# EAGLE design usbkeyboard1 (EAGLE 7.1.0)
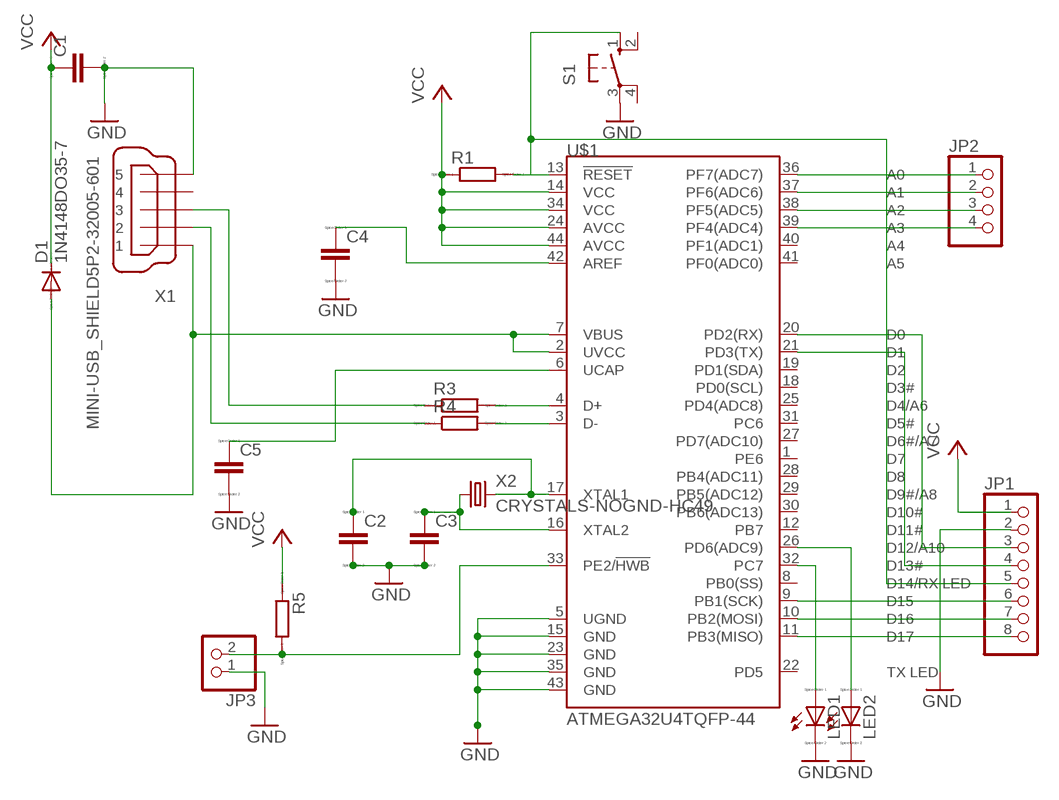
[diagram p0: schematic, sheet 1]

## Parts
C1  CC0603  [C0603]
C2  CC0603  [C0603]
C3  CC0603  [C0603]
C4  CC0603  [C0603]
C5  CC0603  [C0603]
D1  1N4148DO35-7  [DO35-7]
JP1  PINHD-1X8  [1X08]
JP2  PINHD-1X4  [1X04]
JP3  PINHD-1X2  [1X02]
LED1  LED_ELD260  [LED_LD260]
LED2  LED_ELD260  [LED_LD260]
R1  RR0603  [R0603]
R3  RR0603  [R0603]
R4  RR0603  [R0603]
R5  RR0603  [R0603]
S1  10-XX  [B3F-10XX]
U$1  ATMEGA32U4TQFP-44  [TQFP44]
X1  MINI-USB_SHIELD5P2-32005-601  [32005-601]
X2  CRYSTALS-NOGND-HC49  [HC49]

## Nets
GND: C1.2 C2.2 C3.2 C4.2 C5.2 JP1.2 JP3.1 LED1.K(C) LED2.K(C) S1.3(P) U$1.5(UGND) U$1.15(GND) U$1.23(GND) U$1.35(GND) U$1.43(GND) X1.5
N$1: JP1.8 U$1.11(PB3(MISO))
N$2: JP1.5 R1.2 S1.1(S) U$1.13(!RESET)
N$3: D1.A U$1.2(UVCC) U$1.7(VBUS) X1.1
N$4: R3.2 U$1.4(D+)
N$5: R4.2 U$1.3(D-)
N$6: R4.1 X1.2
N$7: R3.1 X1.3
N$8: C2.1 U$1.17(XTAL1) X2.2
N$9: C3.1 U$1.16(XTAL2) X2.1
N$10: JP1.7 U$1.10(PB2(MOSI))
N$11: JP1.6 U$1.9(PB1(SCK))
N$12: JP1.4 U$1.21(PD3(TX))
N$13: JP1.3 U$1.20(PD2(RX))
N$14: JP2.1 U$1.36(PF7(ADC7))
N$15: JP2.2 U$1.37(PF6(ADC6))
N$16: JP2.3 U$1.38(PF5(ADC5))
N$17: JP2.4 U$1.39(PF4(ADC4))
N$18: LED2.A U$1.26(PD6(ADC9))
N$19: LED1.A U$1.32(PC7)
N$20: JP3.2 R5.2 U$1.33(PE2/!HWB)
N$21: C4.1 U$1.42(AREF)
N$22: C5.1 U$1.6(UCAP)
VCC: C1.1 D1.C JP1.1 R1.1 R5.1 U$1.14(VCC) U$1.24(AVCC) U$1.34(VCC) U$1.44(AVCC)
Unconnected: S1.2(S1) S1.4(P1) U$1.1(PE6) U$1.8(PB0(SS)) U$1.12(PB7) U$1.18(PD0(SCL)) U$1.19(PD1(SDA)) U$1.22(PD5) U$1.25(PD4(ADC8)) U$1.27(PD7(ADC10)) U$1.28(PB4(ADC11)) U$1.29(PB5(ADC12)) U$1.30(PB6(ADC13)) U$1.31(PC6) U$1.40(PF1(ADC1)) U$1.41(PF0(ADC0)) X1.4 X1.M1(S1) X1.M2(S2)

## Library data of the parts
C1-C5 = eagle-ltspice:C: CAPACITOR, European symbol; SPICEMODEL: NONE; SPICEPREFIX: C
D1 = diode:1N4148: DIODE high speed (Philips)
JP1 = pinhead:PINHD-1X8: PIN HEADER
JP2 = pinhead:PINHD-1X4: PIN HEADER
JP3 = pinhead:PINHD-1X2: PIN HEADER
LED1 LED2 = eagle-ltspice:LED_E: LED Source: http://www.osram.convergy.de Source: www.luxeon.com Source: www.kingbright.com; SPICEMODEL: NONE; SPICEPREFIX: D; SPICETYPE: diode
R1 R3-R5 = eagle-ltspice:R: RESISTOR, European symbol; SPICEMODEL: NONE; SPICEPREFIX: R
S1 = switch-omron:10-XX: OMRON SWITCH; MPN: B3F-1000; OC_FARNELL: 176432; OC_NEWARK: 36M3542
U$1 = SparkFun-DigitalIC:ATMEGA32U4: Atmel 44-pin 8-bit Microcontroller with 32KBytes of ISP Flash and USB Controller
X1 = con-cypressindustries:MINI-USB_SHIELD5P2-: MINI USB-B R/A DIP 5pol. Source: www.cypressindustries.com; OC_FARNELL: unknown; OC_NEWARK: unknown
X2 = IQD-Frequency-Products:CRYSTALS-NOGND: CRYSTALS CAN NOT GROUNDED

## Board
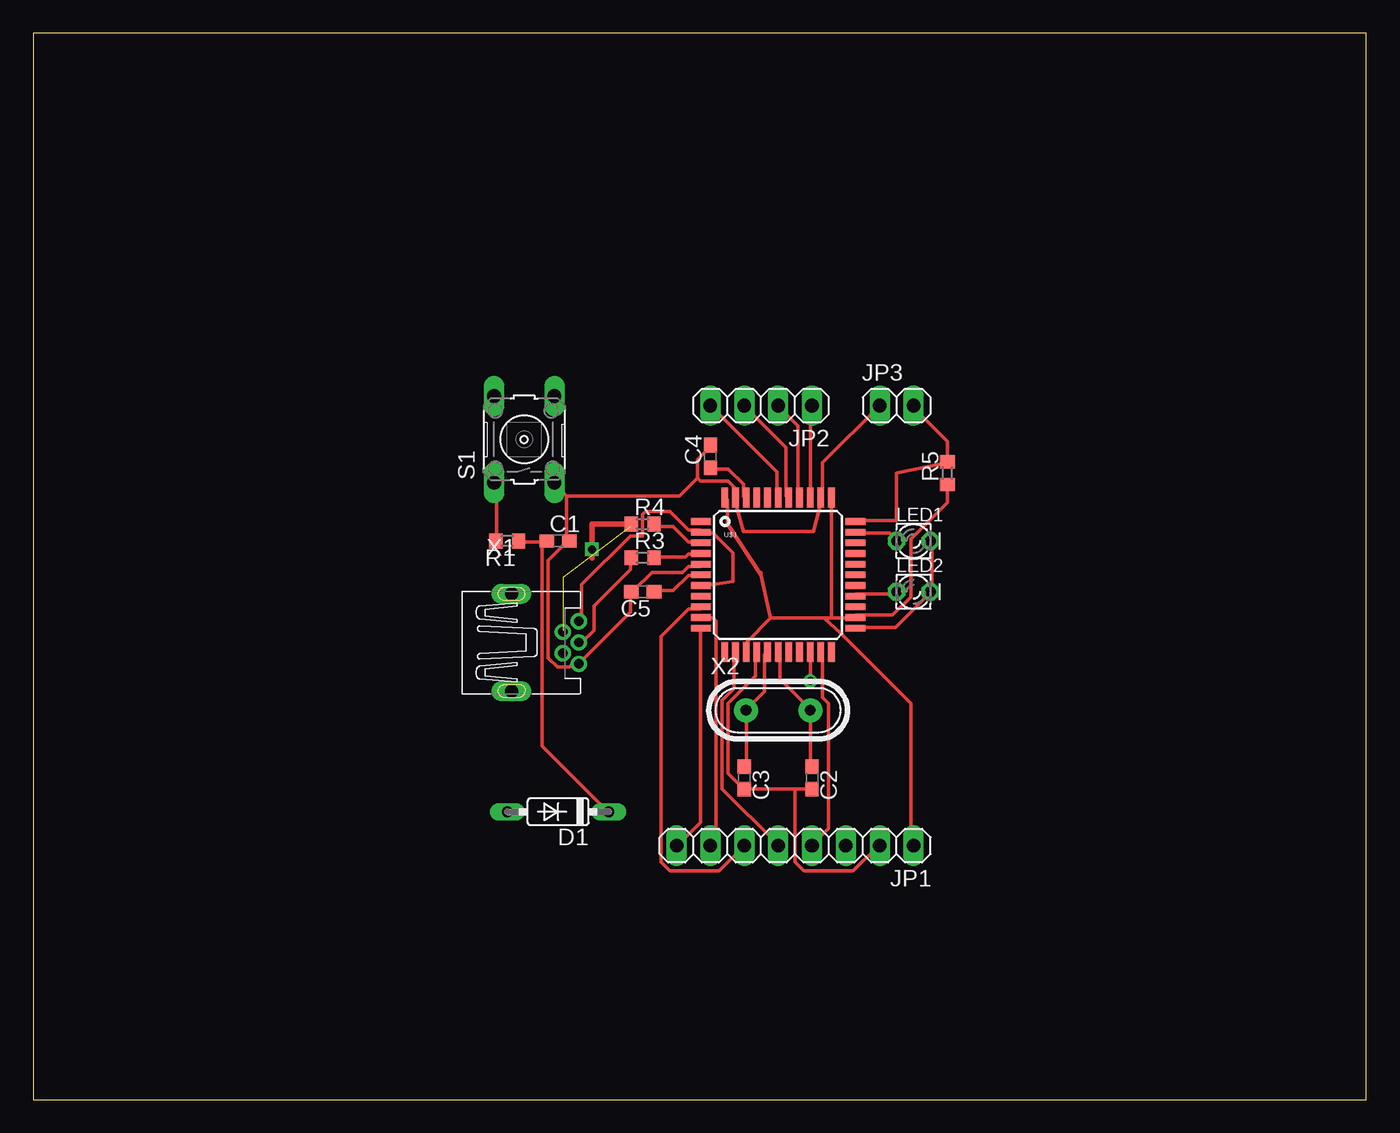
[diagram p1: board, top side]
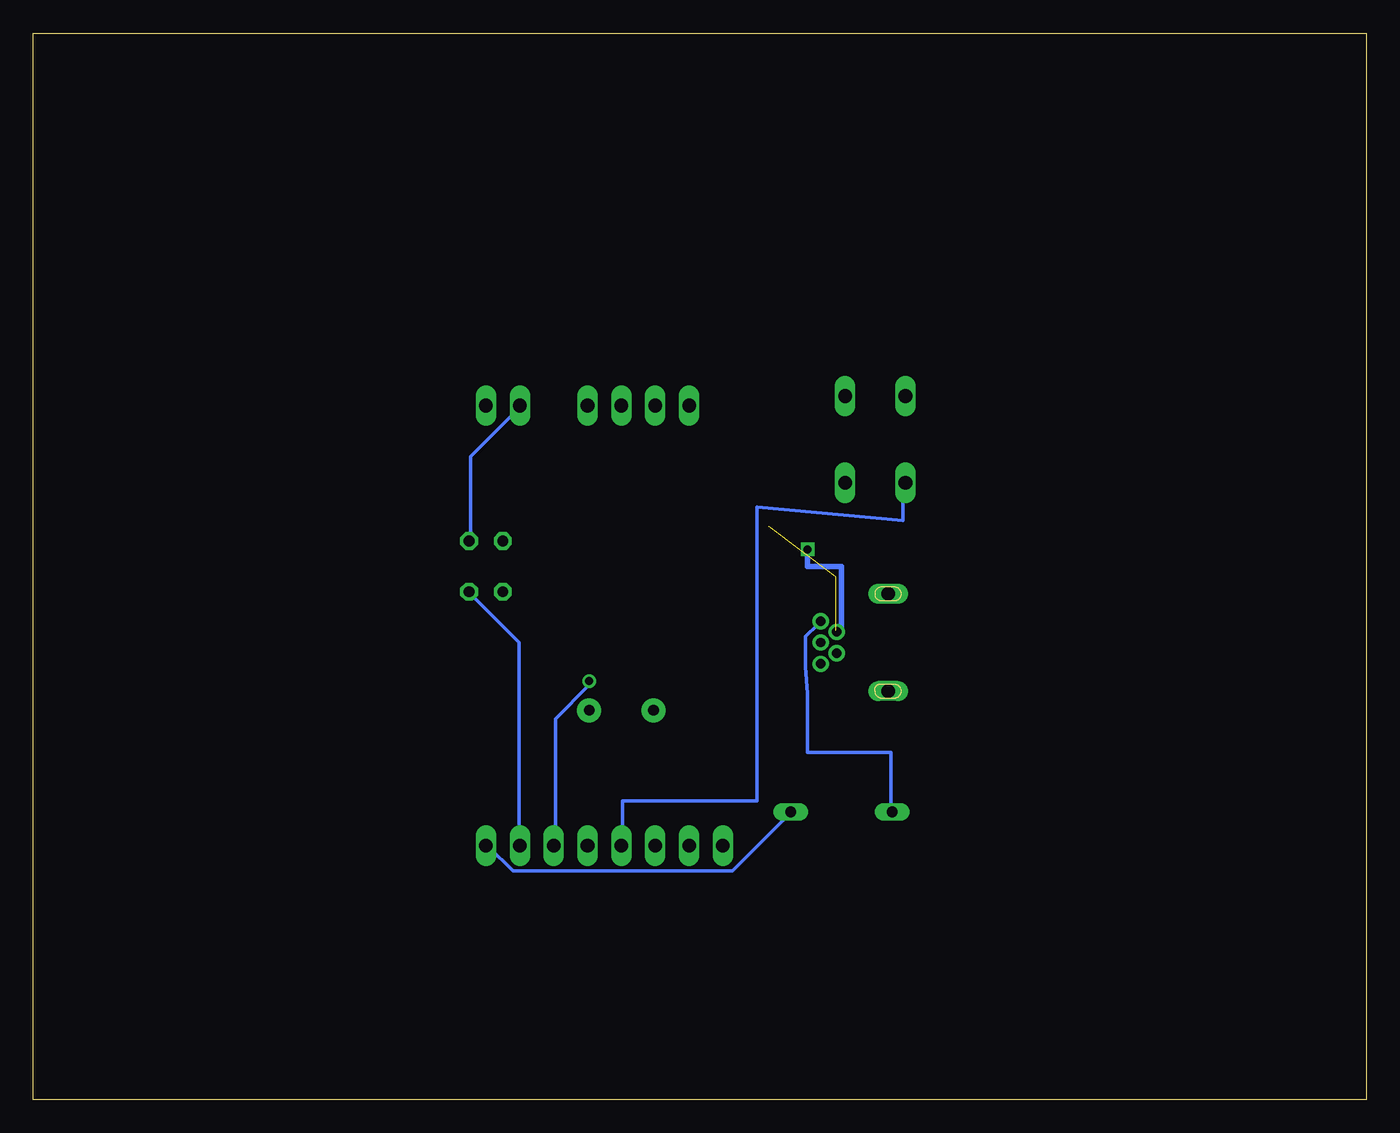
[diagram p2: board, bottom side, seen from below]

Size 100 x 80 mm. Coordinates in mm from the lower left corner, seen from the top.
Outline: 0,0 100,0 100,80 0,80 0,0
Copper layers (1*16): Top 0.035mm / dielectric 1.5mm / Bottom 0.035mm
Design rules "default": minimum track width 10mil, minimum drill 24mil, track to track 8mil, track to pad 8mil, pad to pad 8mil, via to via 8mil, smd to smd 8mil, copper to edge 40mil, drill to drill 8mil, minimum pad ring 10mil, minimum via ring 8mil, stop-mask expansion 4mil, vias tented up to drill 0mil, thermal gap 10mil

### Footprints (pad centres in the part's own frame; a part is rotated, then mirrored left to right if it is on the bottom)
C0603 = smd 1.1 x 1: 1 -0.85,0; 2 0.85,0
DO35-7 = drill 0.813 long: A 3.81,0; C -3.81,0
1X08 = drill 1.016 long: 1 -8.89,0; 2 -6.35,0; 3 -3.81,0; 4 -1.27,0; 5 1.27,0; 6 3.81,0; 7 6.35,0; 8 8.89,0
1X04 = drill 1.016 long: 1 -3.81,0; 2 -1.27,0; 3 1.27,0; 4 3.81,0
1X02 = drill 1.016 long: 1 -1.27,0; 2 1.27,0
LED_LD260 = drill 0.813 octagon: A -1.27,0; K 1.27,0
R0603 = smd 1 x 1.1: 1 -0.85,0; 2 0.85,0
B3F-10XX = drill 1.016 long: 1 -3.251,2.261; 2 3.251,2.261; 3 -3.251,-2.261; 4 3.251,-2.261
TQFP44 = smd 1.5 x 0.5: 1 -5.8,4; 2 -5.8,3.2; 3 -5.8,2.4; 4 -5.8,1.6; 5 -5.8,0.8; 6 -5.8,0; 7 -5.8,-0.8; 8 -5.8,-1.6; 9 -5.8,-2.4; 10 -5.8,-3.2; 11 -5.8,-4; 23 5.8,-4; 24 5.8,-3.2; 25 5.8,-2.4; 26 5.8,-1.6; 27 5.8,-0.8; 28 5.8,0; 29 5.8,0.8; 30 5.8,1.6; 31 5.8,2.4; 32 5.8,3.2; 33 5.8,4 | smd 0.5 x 1.5: 12 -4,-5.8; 13 -3.2,-5.8; 14 -2.4,-5.8; 15 -1.6,-5.8; 16 -0.8,-5.8; 17 0,-5.8; 18 0.8,-5.8; 19 1.6,-5.8; 20 2.4,-5.8; 21 3.2,-5.8; 22 4,-5.8; 34 4,5.8; 35 3.2,5.8; 36 2.4,5.8; 37 1.6,5.8; 38 0.8,5.8; 39 0,5.8; 40 -0.8,5.8; 41 -1.6,5.8; 42 -2.4,5.8; 43 -3.2,5.8; 44 -4,5.8
32005-601 = drill 0.7 pad 1.016: 1 2.825,1.6; 2 1.625,0.8; 3 2.825,0; 4 1.625,-0.8; 5 2.825,-1.6 | drill 1 pad 1.422 long: M1 -2.225,3.65; M2 -2.225,-3.65
HC49 = drill 0.813 pad 1.8: 1 -2.413,0; 2 2.413,0

### Placement (x,y rotation side)
C1  39.37,41.91 0 top
C2  58.42,24.13 270 top
C3  53.34,24.13 270 top
C4  50.8,48.26 90 top
C5  45.72,38.1 180 top
D1  39.37,21.59 180 top
JP1  57.15,19.05 180 top
JP2  54.61,52.07 180 top
JP3  64.77,52.07 0 top
LED1  66.04,41.91 0 top
LED2  66.04,38.1 0 top
R1  35.56,41.91 180 top
R3  45.72,40.64 0 top
R4  45.72,43.18 0 top
R5  68.58,46.99 90 top
S1  36.83,49.53 90 top
U$1  55.88,39.37 0 top
X1  38.1,34.29 0 top
X2  55.88,29.21 0 top

### Tracks (layer width: path | path; a pad name or v marks a point on that pad's centre or on a via)
GND
  Top 0.254: 57.15,23.32 58.29,23.32 C2.2 | 57.15,23.32 53.49,23.32 C3.2 53.26,23.32 52.12,24.46 52.12,29.72 54.18,31.77 54.18,33.38 U$1.15 | 57.15,23.32 57.15,17.83 57.84,17.14 61.49,17.14 63.32,18.97 JP1.2 | U$1.5 50.06,40.01 49.15,40.01 48.69,39.55 46.41,39.55 45.03,38.18 C5.2 44.81,37.95 44.81,36.58 41.15,32.92 X1.5 40.92,32.69 40.46,32.69 40.23,32.46 39.32,32.46 38.63,33.15 38.63,40.46 40.01,41.83 C1.2 40.01,42.06 40.01,45.26 | U$1.23 61.72,35.43 64.69,35.43 67.21,37.95 LED2.K 67.44,38.18 67.44,41.83 LED1.K | 40.01,45.26 39.09,46.18 S1.3 | 49.84,46.63 49.84,48.01 50.75,48.92 C4.2 | 49.84,46.63 50.06,46.41 52.12,46.41 52.58,45.95 52.58,45.26 U$1.43 52.81,45.03 52.81,44.35 53.26,42.62 58.52,42.62 58.98,44.35 58.98,45.03 U$1.35 59.21,45.26 59.21,47.78 JP3.1 | 40.01,45.26 48.46,45.26 49.84,46.63
  Bottom 0.254: LED1.K 67.21,42.06 67.21,48.23 63.55,51.89 JP3.1 | JP1.2 63.55,19.2 63.55,34.29 67.21,37.95 LED2.K
N$1
  Top 0.254: U$1.11 50.06,35.2 50.06,20.8 48.46,19.2 JP1.8
N$2
  Top 0.254: R1.2 34.75,42.06 34.75,46.18 S1.1 | U$1.13 52.58,33.38 52.58,30.86 51.66,29.95 51.66,23.32 55.78,19.2 JP1.5
  Bottom 0.254: S1.1 34.75,46.18 34.75,43.43 45.72,44.45 45.72,22.4 55.78,22.4 55.78,19.2 JP1.5
N$3
  Top 0.254: U$1.7 50.29,38.63 50.98,38.63 52.48,38.86 52.48,41.02 50.98,42.52 50.29,42.52 U$1.2 50.06,42.75 49.15,42.75 47.78,44.12 45.95,44.12 45.72,43.89 45.72,42.29 44.81,42.29 41.15,38.63 41.15,35.89 X1.1
  Bottom 0.254: D1.A 35.66,21.72 35.66,26.06 41.91,26.06 41.91,30.48 42.06,32.46 42.06,34.75 41.15,35.66 X1.1
N$4
  Top 0.254: R3.2 46.63,40.69 48.92,40.69 49.15,40.92 50.06,40.92 U$1.4
N$5
  Top 0.254: R4.2 46.63,42.98 48.01,42.98 49.15,41.83 50.06,41.83 U$1.3
N$6  (2 unrouted)
  Top 0.254: 44.81,42.98 R4.1 | 39.78,35.2 X1.2
N$7
  Top 0.254: R3.1 44.81,40.46 44.81,39.78 42.06,37.03 42.06,35.2 41.15,34.29 X1.3
N$8
  Top 0.254: C2.1 58.29,25.15 X2.2 58.29,29.26 56.01,31.55 56.01,33.38 U$1.17
N$9
  Top 0.254: C3.1 53.49,25.15 53.49,29.03 X2.1 53.49,29.26 54.86,30.63 54.86,33.38 U$1.16
N$10
  Top 0.254: U$1.10 50.29,36.12 50.98,36.12 51.21,35.89 51.21,19.43 50.98,19.2 JP1.7
N$11
  Top 0.254: JP1.6 51.44,17.14 47.78,17.14 47.09,17.83 47.09,34.75 49.15,36.8 50.06,36.8 U$1.9
N$12
  Top 0.254: U$1.21 59.21,33.38 59.21,30.18 59.66,29.72 59.66,20.34 58.52,19.2 JP1.4
N$13  (via drill 0.61)
  Top 0.254: v58.29,31.39 58.29,33.6 U$1.20
  Bottom 0.254: v58.29,31.39 58.29,31.09 60.81,28.57 60.81,19.2 JP1.3
N$14
  Top 0.254: U$1.36 58.29,45.26 58.29,51.89 JP2.1
N$15
  Top 0.254: U$1.37 57.38,45.26 57.38,50.52 56.01,51.89 JP2.2
N$16
  Top 0.254: U$1.38 56.46,45.26 56.46,48.92 53.49,51.89 JP2.3
N$17
  Top 0.254: JP2.4 55.78,47.09 55.78,45.26 U$1.39
N$18
  Top 0.254: U$1.26 61.72,37.95 64.69,37.95 LED2.A
N$19
  Top 0.254: U$1.32 61.72,42.52 64.24,42.52 64.69,42.06 LED1.A
N$20
  Top 0.254: JP3.2 66.06,51.89 68.58,49.38 R5.2 68.58,47.78 64.77,46.99 64.77,43.43 61.72,43.43 U$1.33
N$21
  Top 0.254: C4.1 50.98,47.32 52.12,47.32 53.26,46.18 53.26,45.26 U$1.42
N$22
  Top 0.254: C5.1 46.63,38.18 48.01,38.18 49.15,39.32 50.06,39.32 U$1.6
N$24
  Top 0.406: 44.45,43.18 41.91,43.18 41.91,40.64
N$25  (via drill 0.6)
  Bottom 0.406: 40.01,34.92 39.37,34.92 39.37,40.01 41.91,40.01 v41.91,41.27
VCC
  Top 0.254: 38.18,41.83 38.41,41.83 C1.1 38.18,41.83 | 38.18,41.83 36.58,41.83 R1.1 | 38.18,41.83 38.18,26.52 42.98,21.72 D1.C | R5.1 68.58,44.81 65.84,42.06 65.84,37.72 64.47,36.35 61.72,36.35 U$1.24 61.49,36.12 59.31,36.12 | 55.32,36.12 53.49,34.29 53.49,33.6 U$1.14 | 59.31,36.12 55.32,36.12 | 54.61,39.37 52.07,43.18 52.07,45.03 51.89,45.03 U$1.44 | 55.32,36.12 54.61,39.37 | 54.61,39.37 54.61,39.55 54.43,39.55 | 59.89,36.12 59.89,45.03 U$1.34 | 59.31,36.12 60.58,34.98 65.84,29.72 65.84,19.2 JP1.1
  Bottom 0.254: D1.C 43.2,21.49 47.55,17.14 64.01,17.14 65.84,18.97 JP1.1